# Altium project general-schematics.PrjPCB (part 2 of 2)

## Sheet heater-control-comparator.SchDoc: Heater Control
size A; DrawnBy: B. Almeida, D. Vogel; Organization: UTAT SS; Revision: 1.0
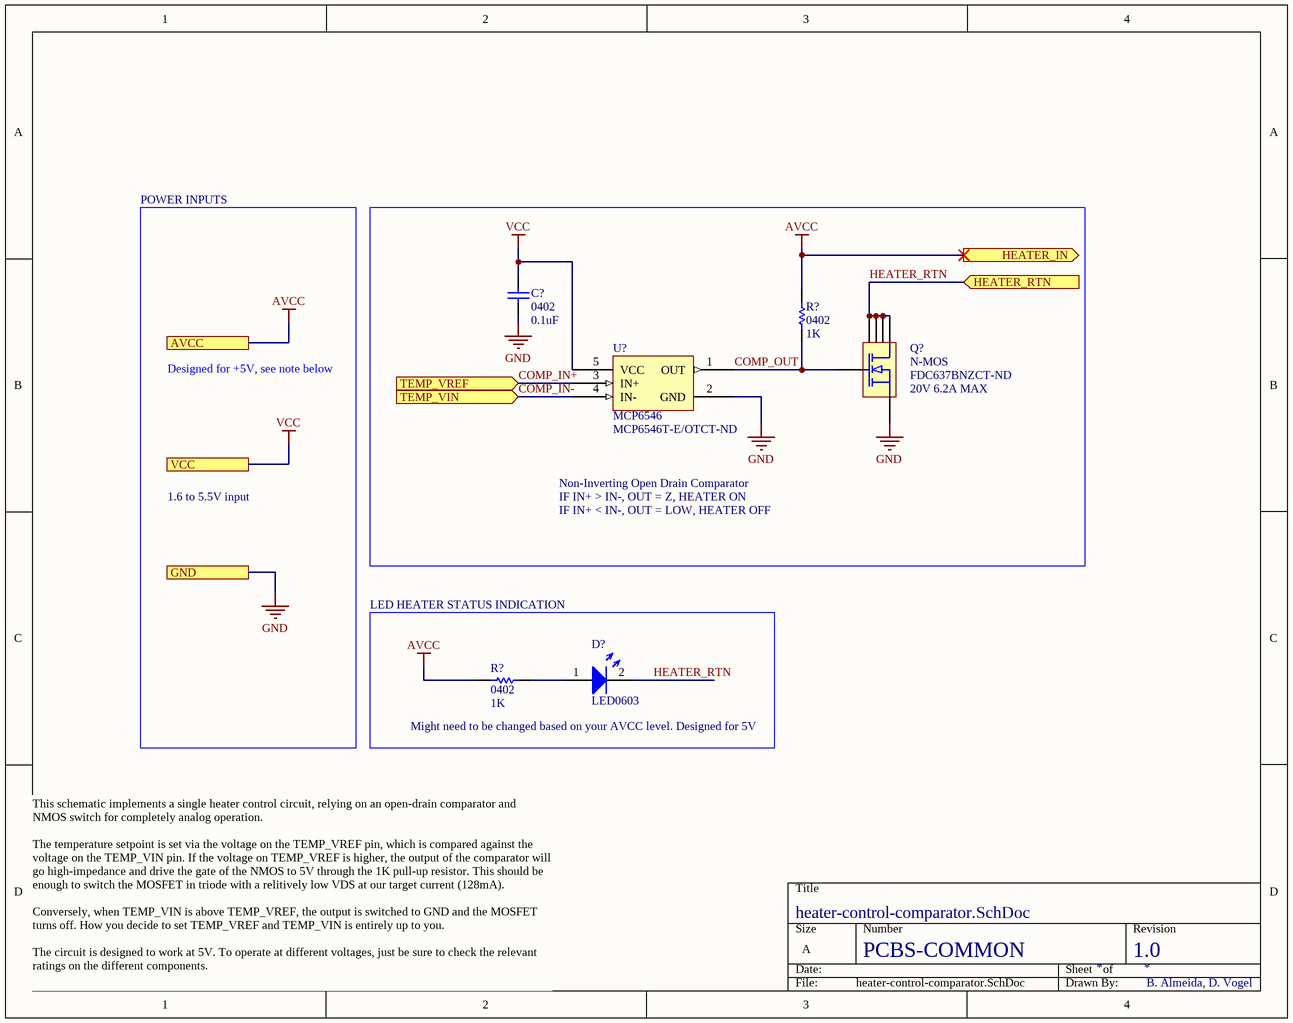
[diagram p7: heater-control-comparator.SchDoc]

### Parts
(Parts that share a designator on the sheet are numbered #1, #2 ... from top to bottom, then left to right.)
C?#25  0402  value 0.1uF  [CAP0402R]
D?#1  LED0603  [LED0603]
Q?  N-MOS  [SOT95P280X145-6N]
R?#23  0402  value 1K  [RES0402R]
R?#24  0402  value 1K  [RES0402R]
U?#9  MCP6546  Supplier Part Number 1: MCP6546T-E/OTCT-ND  [SOT95P290X160-5N]

### Blocks framed on the sheet
LED HEATER STATUS INDICATION: D?#1 R?#24

### Ports
AVCC, GND, HEATER_IN (out), HEATER_RTN (in), TEMP_VIN (in), TEMP_VREF (in), VCC

### Nets
AVCC: R?#23.2 R?#24.1 ; port AVCC, port HEATER_IN
GND: C?#25.1 Q?.4(S) U?#9.2(GND) ; port GND
VCC: C?#25.2 U?#9.5(VCC) ; port VCC
COMP_IN+: U?#9.3(IN+) ; port TEMP_VREF
COMP_IN-: U?#9.4(IN-) ; port TEMP_VIN
COMP_OUT: Q?.3(G) R?#23.1 U?#9.1(OUT)
HEATER_RTN: D?#1.2 Q?.1(D) Q?.2(D) Q?.5(D) Q?.6(D) ; port HEATER_RTN
NetD?#1_1: D?#1.1 R?#24.2

### Notes on the sheet
- POWER INPUTS
- Designed for +5V, see note below
- (near Q?) 20V 6.2A MAX
- 1.6 to 5.5V input
- Non-Inverting Open Drain Comparator
- IF IN+ > IN-, OUT = Z, HEATER ON
- IF IN+ < IN-, OUT = LOW, HEATER OFF
- Might need to be changed based on your AVCC level. Designed for 5V
- PCBS-COMMON
- This schematic implements a single heater control circuit, relying on an open-drain comparator and NMOS switch for completely analog operation.
  The temperature setpoint is set via the voltage on the TEMP_VREF pin, which is compared against the voltage on the TEMP_VIN pin. If the voltage on TEMP_VREF is higher, the output of the comparator will go high-impedance and drive the gate of the NMOS to 5V through the 1K pull-up resistor. This should be enough to switch the MOSFET in triode with a relitively low VDS at our target current (128mA).
  Conversely, when TEMP_VIN is above TEMP_VREF, the output is switched to GND and the MOSFET turns off. How you decide to set TEMP_VREF and TEMP_VIN is entirely up to you.
  The circuit is designed to work at 5V. To operate at different voltages, just be sure to check the relevant ratings on the different components.

### Library data of the parts
C?#25 = CAP0402: 0402 capacitor; Manufacturer: Taiyo Yuden; Manufacturer Part Number: EMK105B7104KVHF; Voltage Rating: 16V; Capacitance: 100nF; Tolerance: 10%; Dielectric: X7R; Supplier 1: Digi-Key; Supplier Part Number 1: 587-3807-1-ND; Stock 1: 18196; Pricing 1: 1=0.1, 10=0.057, 100=0.0254, 500=0.01812, 1000=0.01423, 2500=0.01294, 5000=0.0119 (USD); Mount: Surface Mount; Case/Package: 0402; Weight: 2.3E-05oz; Case Code (Metric): 1005; Case Code (Imperial): 0402; Min Operating Temperature: -55°C; Max Operating Temperature: 125°C; Package Quantity: 10000; Packaging: Tape and Reel; Termination: SMD/SMT; Voltage Rating (DC): 16V; Length: 0.039inch; Height: 0.5mm; Width: 0.02inch; Thickness: 0.022inch; Ratings: AEC-Q200; Lead Free: Lead Free; Halogen Free: Halogen Free
D?#1 = LED0603: Generic 0603 LED. Use ChipLED from Osram for generic ones.
Q? = FDC637BNZCT-ND: 20V 6.2A, N-MOS, low gate on voltage; Supplier 1: Digi-Key; Supplier Part Number 1: FDC637BNZCT-ND
R?#23 R?#24 = RES0402: 0402 resistor; Manufacturer: Panasonic; Manufacturer Part Number: ERJ-PA2J102X; Resistance: 1kR; Tolerance: 5%; Max Power Dissipation: 200mW; Temperature Coefficient: 200ppm/°C; Supplier 1: Digi-Key; Supplier Part Number 1: P17193CT-ND; Stock 1: 7229; Pricing 1: 1=0.16, 10=0.133, 100=0.0518, 1000=0.0217, 2500=0.0199, 5000=0.01809 (USD); Case/Package: 0402; Case Code (Metric): 1005; Case Code (Imperial): 0402; Min Operating Temperature: -55°C; Max Operating Temperature: 155°C; Packaging: Tape and Reel; Composition: Thick Film; Number of Terminations: 2; Features: Automotive AEC-Q200; Length: 0.039inch; Height: 0.016inch; Width: 0.02inch
U?#9 = MCP6546: Open-drain output sub-microamp comparator.; Supplier 1: Digi-Key

## Sheet micro-circuit-ATMEGA64M1.SchDoc: ATMega32M1 Circuit
size A4; DrawnBy: Dylan Vogel; Organization: UTAT SS; Revision: 1.1
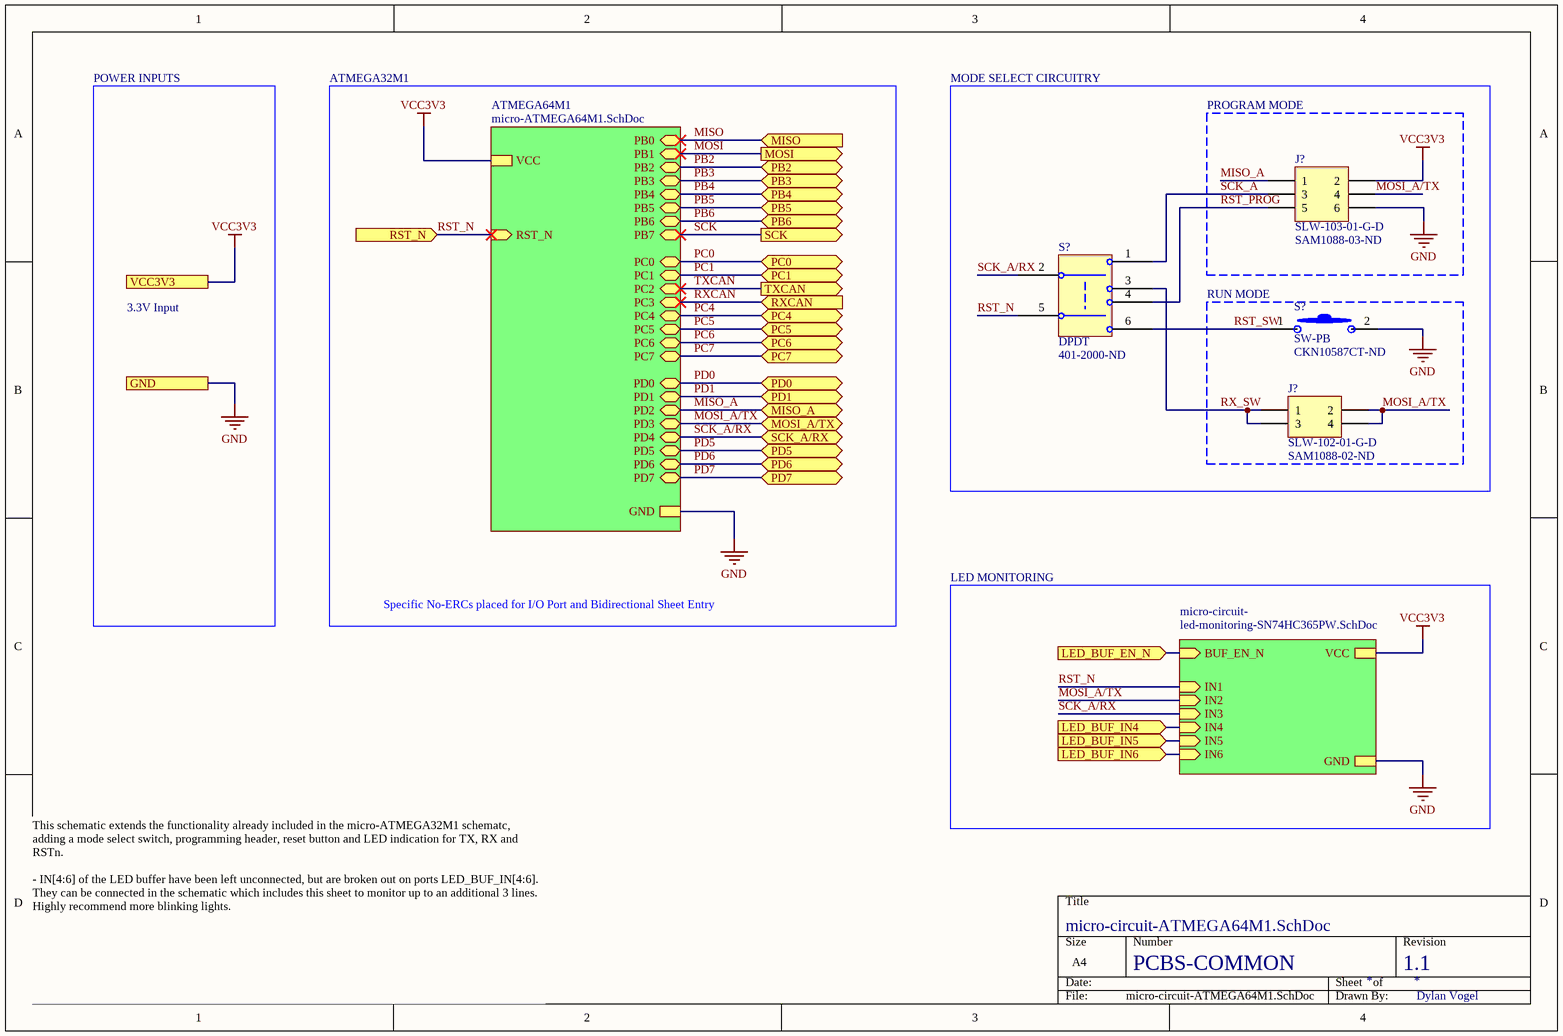
[diagram p8: micro-circuit-ATMEGA64M1.SchDoc]

### Parts
(Parts that share a designator on the sheet are numbered #1, #2 ... from top to bottom, then left to right.)
J?#1  SLW-103-01-G-D  Supplier Part Number 1: SAM1088-03-ND  [SLW-103-01-X-D]
J?#2  SLW-102-01-G-D  Supplier Part Number 1: SAM1088-02-ND  [SLW-102-01-X-D]
S?#1  DPDT  Supplier Part Number 1: 401-2000-ND  [JS202011AQN - Slide Switch]
S?#2  SW-PB  Supplier Part Number 1: CKN10587CT-ND  [PTS830GM140 SMTR LFS - Pushbutton]

### Blocks framed on the sheet
MODE SELECT CIRCUITRY: S?#1
PROGRAM MODE: J?#1
RUN MODE: J?#2 S?#2

### Sub-sheets
ATMEGA64M1 = micro-ATMEGA64M1.SchDoc: GND, PB7 (bidir), RST_N (in), VCC, PD2 (bidir), PC0 (bidir), PD1 (bidir), PD3 (bidir), PD0 (bidir), PC7 (bidir), PD5 (bidir), PC1 (bidir), PC6 (bidir), PB1 (bidir), PB6 (bidir), PC5 (bidir), PC2 (bidir), PB5 (bidir), PC3 (bidir), PD7 (bidir), PB4 (bidir), PB0 (bidir), PC4 (bidir), PD6 (bidir), PB2 (bidir), PB3 (bidir), PD4 (bidir)
micro-circuit- = led-monitoring-SN74HC365PW.SchDoc: IN4 (in), VCC, IN3 (in), IN1 (in), GND, IN2 (in), IN6 (in), IN5 (in), BUF_EN_N (in)  | LED1: GREEN LED; LED2: ORANGE LED; LED3: ORANGE LED

### Ports
GND, LED_BUF_EN_N (in), LED_BUF_IN4 (in), LED_BUF_IN5 (in), LED_BUF_IN6 (in), MISO (in), MISO_A (bidir), MOSI (out), MOSI_A/TX (bidir), PB2 (bidir), PB3 (bidir), PB4 (bidir), PB5 (bidir), PB6 (bidir), PC0 (bidir), PC1 (bidir), PC4 (bidir), PC5 (bidir), PC6 (bidir), PC7 (bidir), PD0 (bidir), PD1 (bidir), PD5 (bidir), PD6 (bidir), PD7 (bidir), RST_N (in), RXCAN (in), SCK (out), SCK_A/RX (bidir), TXCAN (out), VCC3V3

### Nets
GND: J?#1.6 S?#2.2 ; port GND, sheet micro-circuit-/GND, sheet ATMEGA64M1/GND
VCC3V3: J?#1.2 ; port VCC3V3, sheet micro-circuit-/VCC, sheet ATMEGA64M1/VCC  [project net VCC]
BUF_EN_N: port LED_BUF_EN_N, sheet micro-circuit-/BUF_EN_N
IN4: port LED_BUF_IN4, sheet micro-circuit-/IN4
IN5: port LED_BUF_IN5, sheet micro-circuit-/IN5
IN6: port LED_BUF_IN6, sheet micro-circuit-/IN6
MISO: port MISO, sheet ATMEGA64M1/PB0
MISO_A: J?#1.1 ; port MISO_A, sheet ATMEGA64M1/PD2
MOSI: port MOSI, sheet ATMEGA64M1/PB1
MOSI_A/TX: J?#1.4 J?#2.2 J?#2.4 ; port MOSI_A/TX, sheet micro-circuit-/IN2, sheet ATMEGA64M1/PD3
PB2: port PB2, sheet ATMEGA64M1/PB2
PB3: port PB3, sheet ATMEGA64M1/PB3
PB4: port PB4, sheet ATMEGA64M1/PB4
PB5: port PB5, sheet ATMEGA64M1/PB5
PB6: port PB6, sheet ATMEGA64M1/PB6
PC0: port PC0, sheet ATMEGA64M1/PC0
PC1: port PC1, sheet ATMEGA64M1/PC1
PC4: port PC4, sheet ATMEGA64M1/PC4
PC5: port PC5, sheet ATMEGA64M1/PC5
PC6: port PC6, sheet ATMEGA64M1/PC6
PC7: port PC7, sheet ATMEGA64M1/PC7
PD0: port PD0, sheet ATMEGA64M1/PD0
PD1: port PD1, sheet ATMEGA64M1/PD1
PD5: port PD5, sheet ATMEGA64M1/PD5
PD6: port PD6, sheet ATMEGA64M1/PD6
PD7: port PD7, sheet ATMEGA64M1/PD7
RST_N: S?#1.5(POLE2) ; port RST_N, sheet micro-circuit-/IN1, sheet ATMEGA64M1/RST_N
RST_PROG: J?#1.5 S?#1.4(POLE2A)
RST_SW: S?#1.6(POLE2B) S?#2.1
RX_SW: J?#2.1 J?#2.3 S?#1.3(POLE1B)
RXCAN: port RXCAN, sheet ATMEGA64M1/PC3
SCK: port SCK, sheet ATMEGA64M1/PB7
SCK_A: J?#1.3 S?#1.1(POLE1A)
SCK_A/RX: S?#1.2(POLE1) ; port SCK_A/RX, sheet micro-circuit-/IN3, sheet ATMEGA64M1/PD4
TXCAN: port TXCAN, sheet ATMEGA64M1/PC2

### Notes on the sheet
- POWER INPUTS
- ATMEGA32M1
- 3.3V Input
- LED MONITORING
- Specific No-ERCs placed for I/O Port and Bidirectional Sheet Entry
- PCBS-COMMON
- This schematic extends the functionality already included in the micro-ATMEGA32M1 schematc, adding a mode select switch, programming header, reset button and LED indication for TX, RX and RSTn.
  - IN[4:6] of the LED buffer have been left unconnected, but are broken out on ports LED_BUF_IN[4:6]. They can be connected in the schematic which includes this sheet to monitor up to an additional 3 lines. Highly recommend more blinking lights.

### Library data of the parts
J?#1 = SLW-103-01-G-D: 6 pos 100mil pitch low profile header; Supplier 1: Digi-Key
J?#2 = SLW-102-01-G-D: 4 pos 100mil pitch low profile header; Supplier 1: Digi-Key
S?#1 = DPDT Switch: DPDT Switch, customized for the pinout of the JS202011AQN switch.; Supplier 1: Digi-Key
S?#2 = Pushbutton - Low Profile: Schematic symbol for a generic 2-pin pushbutton, OFF-mom.; Supplier 1: Digi-Key

## Sheet led-monitoring-SN74HC365PW.SchDoc: SN74HC365PW LED Monitoring
size A4; DrawnBy: Dylan Vogel; Organization: UTAT SS; Revision: 1.1
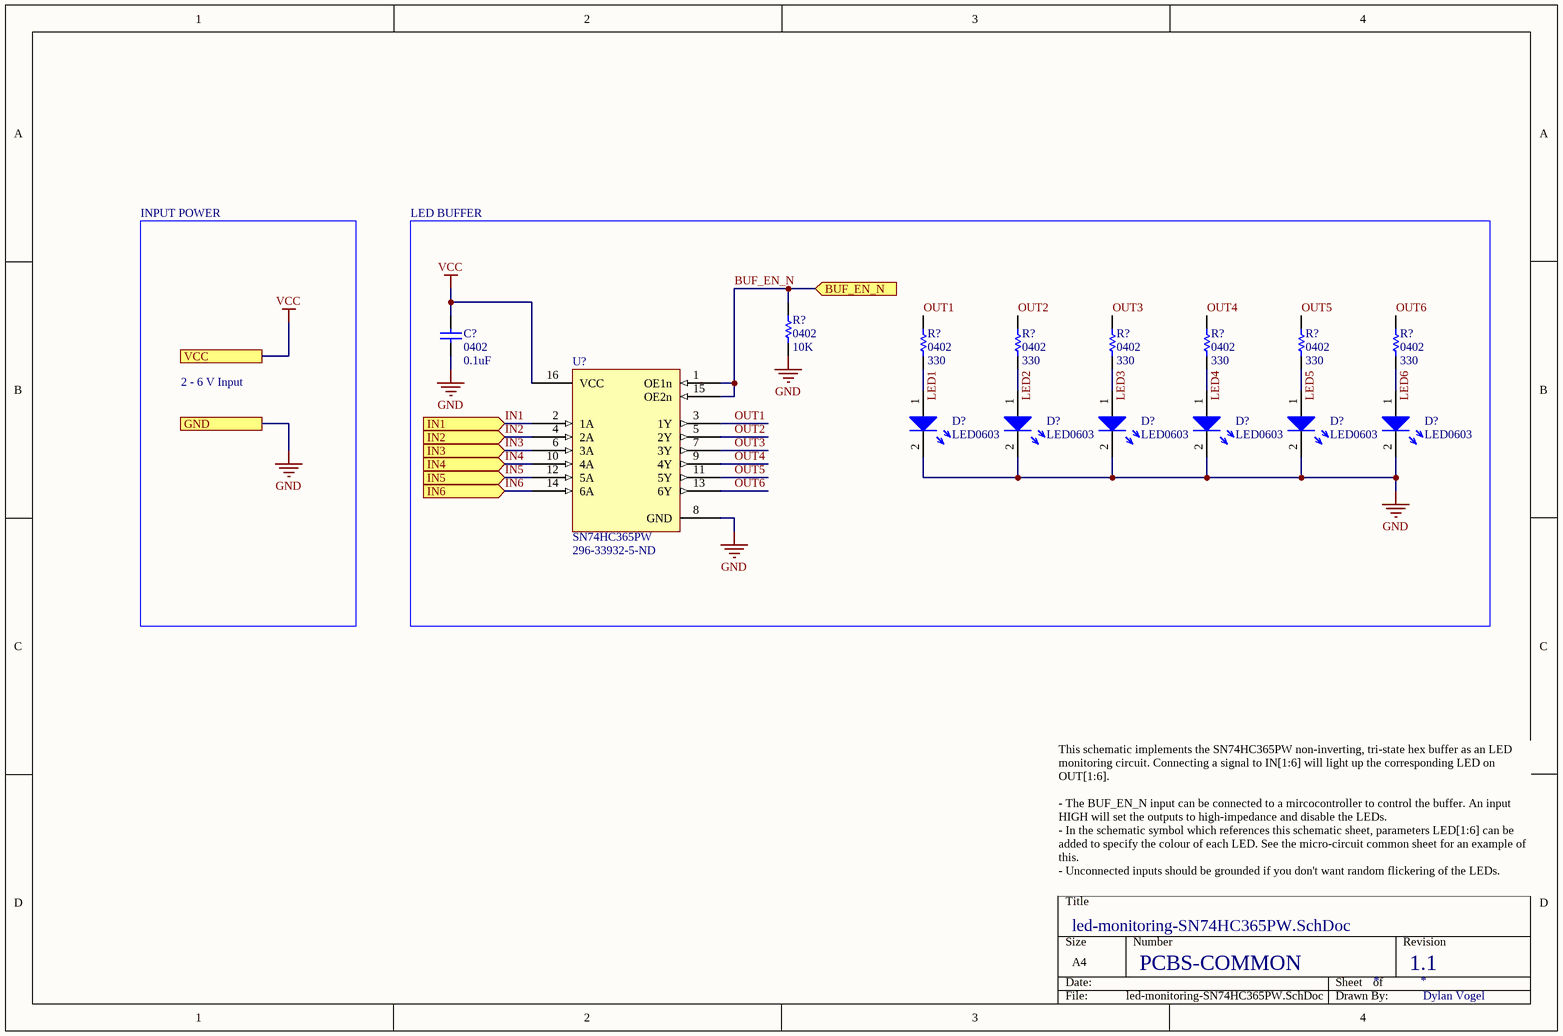
[diagram p9: led-monitoring-SN74HC365PW.SchDoc]

### Parts
(Parts that share a designator on the sheet are numbered #1, #2 ... from top to bottom, then left to right.)
C?#26  0402  value 0.1uF  [CAP0402R]
D?#2  LED0603  [LED0603]
D?#3  LED0603  [LED0603]
D?#4  LED0603  [LED0603]
D?#5  LED0603  [LED0603]
D?#6  LED0603  [LED0603]
D?#7  LED0603  [LED0603]
R?#25  0402  value 10K  [RES0402R]
R?#26  0402  value 330  [RES0402R]
R?#27  0402  value 330  [RES0402R]
R?#28  0402  value 330  [RES0402R]
R?#29  0402  value 330  [RES0402R]
R?#30  0402  value 330  [RES0402R]
R?#31  0402  value 330  [RES0402R]
U?#10  SN74HC365PW  Supplier Part Number 1: 296-33932-5-ND  [SOP65P640X120-16N]

### Blocks framed on the sheet
LED BUFFER: C?#26 D?#2-D?#7 R?#25-R?#31 U?#10

### Ports
BUF_EN_N (in), GND, IN1 (in), IN2 (in), IN3 (in), IN4 (in), IN5 (in), IN6 (in), VCC

### Nets
GND: C?#26.1 D?#2.2 D?#3.2 D?#4.2 D?#5.2 D?#6.2 D?#7.2 R?#25.1 U?#10.8(GND) ; port GND
VCC: C?#26.2 U?#10.16(VCC) ; port VCC
BUF_EN_N: R?#25.2 U?#10.1(OE1n) U?#10.15(OE2n) ; port BUF_EN_N
IN1: U?#10.2(1A) ; port IN1  [project net RST_N]
IN2: U?#10.4(2A) ; port IN2  [project net MOSI_A/TX]
IN3: U?#10.6(3A) ; port IN3  [project net SCK_A/RX]
IN4: U?#10.10(4A) ; port IN4
IN5: U?#10.12(5A) ; port IN5
IN6: U?#10.14(6A) ; port IN6
LED1: D?#2.1 R?#26.1
LED2: D?#3.1 R?#27.1
LED3: D?#4.1 R?#28.1
LED4: D?#5.1 R?#29.1
LED5: D?#6.1 R?#30.1
LED6: D?#7.1 R?#31.1
OUT1: R?#26.2 U?#10.3(1Y)
OUT2: R?#27.2 U?#10.5(2Y)
OUT3: R?#28.2 U?#10.7(3Y)
OUT4: R?#29.2 U?#10.9(4Y)
OUT5: R?#30.2 U?#10.11(5Y)
OUT6: R?#31.2 U?#10.13(6Y)

### Notes on the sheet
- INPUT POWER
- 2 - 6 V Input
- This schematic implements the SN74HC365PW non-inverting, tri-state hex buffer as an LED monitoring circuit. Connecting a signal to IN[1:6] will light up the corresponding LED on OUT[1:6].
  - The BUF_EN_N input can be connected to a mircocontroller to control the buffer. An input HIGH will set the outputs to high-impedance and disable the LEDs.
  - In the schematic symbol which references this schematic sheet, parameters LED[1:6] can be added to specify the colour of each LED. See the micro-circuit common sheet for an example of this.
  - Unconnected inputs should be grounded if you don't want random flickering of the LEDs.
- PCBS-COMMON

### Library data of the parts
C?#26 = CAP0402: 0402 capacitor; Manufacturer: Taiyo Yuden; Manufacturer Part Number: EMK105B7104KVHF; Description: Multilayer Ceramic Capacitors MLCC - SMD/SMT 0.1uF 16V X7R +/-10% 0402 AEC-Q200; Voltage Rating: 16V; Capacitance: 100nF; Tolerance: 10%; Dielectric: X7R; Supplier 1: Digi-Key; Supplier Part Number 1: 587-3807-1-ND; Stock 1: 18196; Pricing 1: 1=0.1, 10=0.057, 100=0.0254, 500=0.01812, 1000=0.01423, 2500=0.01294, 5000=0.0119 (USD); Mount: Surface Mount; Case/Package: 0402; Weight: 2.3E-05oz; Case Code (Metric): 1005; Case Code (Imperial): 0402; Min Operating Temperature: -55°C; Max Operating Temperature: 125°C; Package Quantity: 10000; Packaging: Tape and Reel; Termination: SMD/SMT; Voltage Rating (DC): 16V; Length: 0.039inch; Height: 0.5mm; Width: 0.02inch; Thickness: 0.022inch; Ratings: AEC-Q200; Lead Free: Lead Free; Halogen Free: Halogen Free
D?#2-D?#7 = LED0603: as D?#1 on sheet heater-control-comparator
R?#25 = RES0402: 0402 resistor; Manufacturer: Panasonic; Manufacturer Part Number: ERJ-2RKF1002X; Description: RES SMD 10K OHM 1% 1/10W 0402; Resistance: 10kR; Power Rating: 100mW; Tolerance: 1%; Voltage Rating: 50V; Temperature Coefficient: 100ppm/°C; Supplier 1: Digi-Key; Supplier Part Number 1: P10.0KLCT-ND; Stock 1: 14350001; Pricing 1: 1=0.1, 10=0.045, 100=0.0183, 1000=0.00823, 2500=0.00715, 5000=0.0059 (USD); Mount: Surface Mount; Case/Package: 0402; Number of Pins: 2; Case Code (Metric): 1005; Case Code (Imperial): 0402; Contact Plating: Tin; Min Operating Temperature: -55°C; Max Operating Temperature: 155°C; Packaging: Tape and Reel; Package Quantity: 1; Composition: Thick Film; Number of Terminations: 2; Termination: SMD/SMT; Military Standard: Not; Max Power Dissipation: 100mW; Voltage Rating (DC): 50V; Features: Automotive AEC-Q200; Length: 1mm; Height: 0.35mm; Width: 0.02inch; Depth: 0.5mm; Radiation Hardening: No; REACH SVHC: No SVHC; Lead Free: Lead Free; ComponentLink1URL: http://industrial.panasonic.com/www-data/pdf/AOA0000/AOA0000CE2.pdf?src-supplier=Future+Electronics; ComponentLink1Description: http://industrial.panasonic.com/www-data/pdf/AOA0000/AOA0000CE2.pdf?src-supplier=Future+Electronics; ComponentLink2URL: http://industrial.panasonic.com/www-data/pdf/AOA0000/AOA0000CE2.pdf?src-supplier=Avnet+Europe; ComponentLink2Description: http://industrial.panasonic.com/www-data/pdf/AOA0000/AOA0000CE2.pdf?src-supplier=Avnet+Europe; ComponentLink3URL: https://industrial.panasonic.com/cdbs/www-data/pdf/RDA0000/DMA0000COL11.pdf?src-supplier=Mouser; ComponentLink3Description: https://industrial.panasonic.com/cdbs/www-data/pdf/RDA0000/DMA0000COL11.pdf?src-supplier=Mouser; ComponentLink4URL: http://www.farnell.com/datasheets/1678782.pdf?src-supplier=Element14; ComponentLink4Description: http://www.farnell.com/datasheets/1678782.pdf?src-supplier=Element14; ComponentLink5URL: http://www.farnell.com/datasheets/1911175.pdf?src-supplier=Farnell; ComponentLink5Description: http://www.farnell.com/datasheets/1911175.pdf?src-supplier=Farnell; ComponentLink6URL: http://www.jameco.com/Jameco/Products/ProdDS/1987020.pdf?src-supplier=Jameco; ComponentLink6Description: http://www.jameco.com/Jameco/Products/ProdDS/1987020.pdf?src-supplier=Jameco; ComponentLink7URL: http://industrial.panasonic.com/www-data/pdf/AOA0000/AOA0000CE2.pdf?src-supplier=Avnet; ComponentLink7Description: http://industrial.panasonic.com/www-data/pdf/AOA0000/AOA0000CE2.pdf?src-supplier=Avnet; ComponentLink8URL: http://www.alliedelec.com/m/d/623f45ff1957d936ff56d46fd1c28cac.pdf?src-supplier=Allied+Electronics; ComponentLink8Description: http://www.alliedelec.com/m/d/623f45ff1957d936ff56d46fd1c28cac.pdf?src-supplier=Allied+Electronics
R?#26-R?#31 = RES0402: 0402 resistor; Manufacturer: TE Connectivity; Manufacturer Part Number: CRGCQ0402F330R; Description: CRGCQ 0402 330R 1%; Resistance: 330R; Tolerance: 1%; Max Power Dissipation: 63mW; Temperature Coefficient: 100ppm/°C; Supplier 1: Digi-Key; Supplier Part Number 1: A129621CT-ND; Stock 1: 224275; Pricing 1: 1=0.1, 10=0.022, 100=0.009, 1000=0.00406, 2500=0.00352, 5000=0.00291 (USD); Case/Package: 0402; Case Code (Imperial): 0402; Case Code (Metric): 1005; Min Operating Temperature: -55°C; Max Operating Temperature: 155°C; Composition: Thick Film; Features: Moisture Resistant,Automotive AEC-Q200; Packaging: Tape and Reel; Number of Terminations: 2
U?#10 = SN74HC365PW: Hex non-inverting buffer with 3-state outputs; Supplier 1: Digi-Key

## Sheet micro-ATMEGA64M1.SchDoc: ATMega32M1
size A4; DrawnBy: Dylan Vogel; Organization: UTAT SS; Revision: 1.1
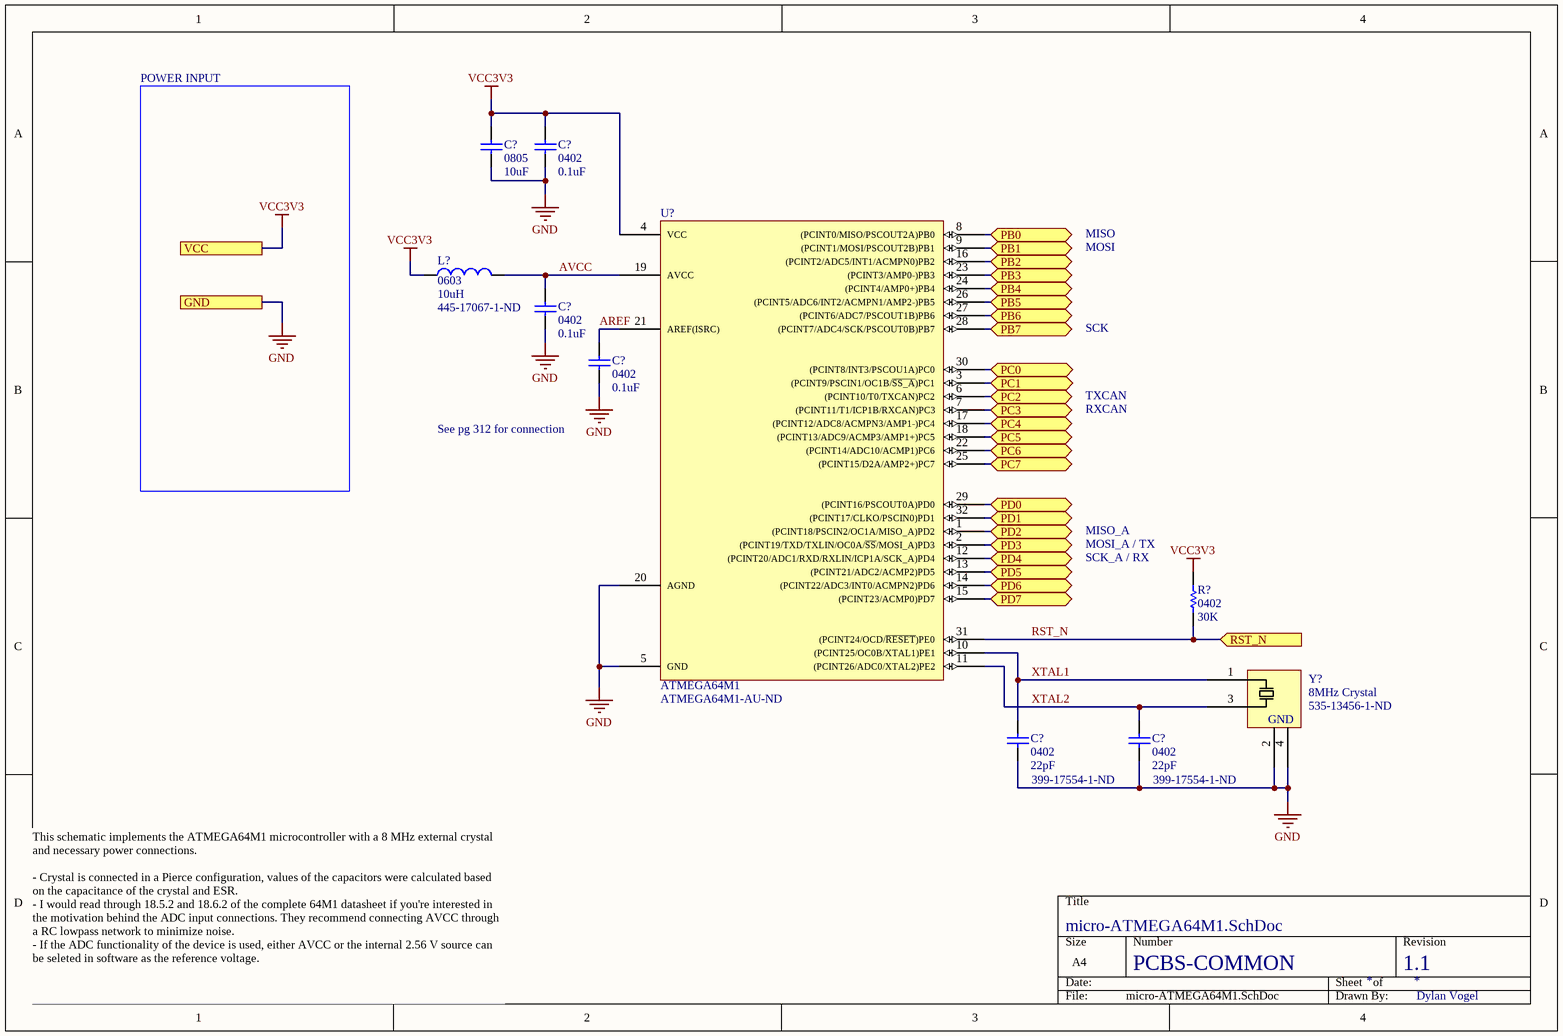
[diagram p10: micro-ATMEGA64M1.SchDoc]

### Parts
(Parts that share a designator on the sheet are numbered #1, #2 ... from top to bottom, then left to right.)
C?#27  0805  value 10uF  [CAP0805R]
C?#28  0402  value 0.1uF  [CAP0402R]
C?#29  0402  value 0.1uF  [CAP0402R]
C?#30  0402  value 0.1uF  [CAP0402R]
C?#31  0402  value 22pF  Supplier Part Number 1: 399-17554-1-ND  [CAP0402R]
C?#32  0402  value 22pF  Supplier Part Number 1: 399-17554-1-ND  [CAP0402R]
L?  0603  value 10uH  Supplier Part Number 1: 445-17067-1-ND  [RES0603R]
R?#32  0402  value 30K  [RES0402R]
U?#11  ATMEGA64M1  Supplier Part Number 1: ATMEGA64M1-AU-ND  [QFP80P900X900X120-32]
Y?  8MHz Crystal  Supplier Part Number 1: 535-13456-1-ND  [OSCSC500X320X110-4N]

### Ports
GND, PB0 (bidir), PB1 (bidir), PB2 (bidir), PB3 (bidir), PB4 (bidir), PB5 (bidir), PB6 (bidir), PB7 (bidir), PC0 (bidir), PC1 (bidir), PC2 (bidir), PC3 (bidir), PC4 (bidir), PC5 (bidir), PC6 (bidir), PC7 (bidir), PD0 (bidir), PD1 (bidir), PD2 (bidir), PD3 (bidir), PD4 (bidir), PD5 (bidir), PD6 (bidir), PD7 (bidir), RST_N (in), VCC

### Nets
GND: C?#27.1 C?#28.1 C?#29.1 C?#30.1 C?#31.1 C?#32.1 U?#11.5(GND) U?#11.20(AGND) Y?.2 Y?.4 ; port GND
VCC3V3: C?#27.2 C?#28.2 L?.1 R?#32.2 U?#11.4(VCC) ; port VCC  [project net VCC]
AREF: C?#30.2 U?#11.21(AREF(ISRC))
AVCC: C?#29.2 L?.2 U?#11.19(AVCC)
MISO: U?#11.8((PCINT0/MISO/PSCOUT2A)PB0) ; port PB0
MISO_A: U?#11.1((PCINT18/PSCIN2/OC1A/MISO_A)PD2) ; port PD2
MOSI: U?#11.9((PCINT1/MOSI/PSCOUT2B)PB1) ; port PB1
MOSI_A/TX: U?#11.2((PCINT19/TXD/TXLIN/OC0A/~{SS}/MOSI_A)PD3) ; port PD3
PB2: U?#11.16((PCINT2/ADC5/INT1/ACMPN0)PB2) ; port PB2
PB3: U?#11.23((PCINT3/AMP0-)PB3) ; port PB3
PB4: U?#11.24((PCINT4/AMP0+)PB4) ; port PB4
PB5: U?#11.26((PCINT5/ADC6/INT2/ACMPN1/AMP2-)PB5) ; port PB5
PB6: U?#11.27((PCINT6/ADC7/PSCOUT1B)PB6) ; port PB6
PC0: U?#11.30((PCINT8/INT3/PSCOU1A)PC0) ; port PC0
PC1: U?#11.3((PCINT9/PSCIN1/OC1B/~{SS_A})PC1) ; port PC1
PC4: U?#11.17((PCINT12/ADC8/ACMPN3/AMP1-)PC4) ; port PC4
PC5: U?#11.18((PCINT13/ADC9/ACMP3/AMP1+)PC5) ; port PC5
PC6: U?#11.22((PCINT14/ADC10/ACMP1)PC6) ; port PC6
PC7: U?#11.25((PCINT15/D2A/AMP2+)PC7) ; port PC7
PD0: U?#11.29((PCINT16/PSCOUT0A)PD0) ; port PD0
PD1: U?#11.32((PCINT17/CLKO/PSCIN0)PD1) ; port PD1
PD5: U?#11.13((PCINT21/ADC2/ACMP2)PD5) ; port PD5
PD6: U?#11.14((PCINT22/ADC3/INT0/ACMPN2)PD6) ; port PD6
PD7: U?#11.15((PCINT23/ACMP0)PD7) ; port PD7
RST_N: R?#32.1 U?#11.31((PCINT24/OCD/~{RESET})PE0) ; port RST_N
RXCAN: U?#11.7((PCINT11/T1/ICP1B/RXCAN)PC3) ; port PC3
SCK: U?#11.28((PCINT7/ADC4/SCK/PSCOUT0B)PB7) ; port PB7
SCK_A/RX: U?#11.12((PCINT20/ADC1/RXD/RXLIN/ICP1A/SCK_A)PD4) ; port PD4
TXCAN: U?#11.6((PCINT10/T0/TXCAN)PC2) ; port PC2
XTAL1: C?#31.2 U?#11.10((PCINT25/OC0B/XTAL1)PE1) Y?.1(IN)
XTAL2: C?#32.2 U?#11.11((PCINT26/ADC0/XTAL2)PE2) Y?.3(IN)

### Notes on the sheet
- POWER INPUT
- MOSI
- MISO
- SCK
- See pg 312 for connection
- TXCAN
- RXCAN
- (near R?#32) MOSI_A / TX
- MISO_A
- (near R?#32) SCK_A / RX
- PCBS-COMMON
- This schematic implements the ATMEGA64M1 microcontroller with a 8 MHz external crystal and necessary power connections.
  - Crystal is connected in a Pierce configuration, values of the capacitors were calculated based on the capacitance of the crystal and ESR.
  - I would read through 18.5.2 and 18.6.2 of the complete 64M1 datasheet if you're interested in the motivation behind the ADC input connections. They recommend connecting AVCC through a RC lowpass network to minimize noise.
  - If the ADC functionality of the device is used, either AVCC or the internal 2.56 V source can be seleted in software as the reference voltage.
- (in symbol AMB3B-8MHz) GND

### Library data of the parts
C?#27 = CAP0805: 0805 capacitor; Manufacturer: Murata; Manufacturer Part Number: GCM21BR70J106KE22K; Description: Cap Ceramic 10uF 6.3V X7R 10% SMD 0805 125C Embossed T/R; Tolerance: 10%; Dielectric: X7R; Voltage Rating (DC): 6.3V; Supplier 1: Digi-Key; Supplier Part Number 1: 490-14361-1-ND; Stock 1: 214938; Pricing 1: 1=0.42, 10=0.29, 100=0.1742, 500=0.13064, 1000=0.11031, 2500=0.10451, 5000=0.0987 (USD); Case/Package: 0805; Min Operating Temperature: -55°C; Max Operating Temperature: 125°C; Capacitance: 10uF; Packaging: Tape and Reel; Length: 2mm; Depth: 1.25mm; Lead Free: Lead Free
C?#28-C?#30 = CAP0402: as C?#26 on sheet led-monitoring-SN74HC365PW; Supplier 1: Digi-Key; Supplier Part Number 1: 587-3807-1-ND; Stock 1: 18196; Pricing 1: 1=0.1, 10=0.057, 100=0.0254, 500=0.01812, 1000=0.01423, 2500=0.01294, 5000=0.0119 (USD); Mount: Surface Mount; Case/Package: 0402; Weight: 2.3E-05oz; Case Code (Metric): 1005; Case Code (Imperial): 0402; Min Operating Temperature: -55°C; Max Operating Temperature: 125°C; Package Quantity: 10000; Packaging: Tape and Reel; Termination: SMD/SMT; Voltage Rating (DC): 16V; Length: 0.039inch; Height: 0.5mm; Width: 0.02inch; Thickness: 0.022inch; Ratings: AEC-Q200; Lead Free: Lead Free; Halogen Free: Halogen Free
C?#31 C?#32 = CAP0402: 0402 capacitor; Manufacturer: KEMET; Manufacturer Part Number: C0402C220K4RAC7867; Description: CAP CER SMD 0402 22PF 10% X7R 16; Tolerance: 10%; Voltage Rating: 16V; Supplier 1: Digi-Key; Stock 1: 68765; Pricing 1: 1=0.19, 10=0.132, 100=0.062, 500=0.0435, 1000=0.03601, 2500=0.03351, 5000=0.03066 (USD); Mount: Surface Mount; Case/Package: 0402; Case Code (Imperial): 0402; Case Code (Metric): 1005; Min Operating Temperature: -55°C; Max Operating Temperature: 125°C; Packaging: Tape and Reel; Capacitance: 22pF
L? = Inductor: Manufacturer: TDK; Manufacturer Part Number: MLZ1608N100LTD25; Code_IEC: 1005; Core Material: Ferrite; Saturation Current: 60mA; Shielding: Shielded; Tolerance: 20%; Current Rating: 300mA; DC Resistance (DCR): 780mR; Test Frequency: 2MHz; Published: 8-Jun-2000; LatestRevisionDate: 29-May-2009; LatestRevisionNote: IPC-7351 Footprint Added.; PackageReference: 0402-A; Publisher: Altium Limited; PackageDescription: Chip Inductor; Code_JEITA: 0402; Supplier 1: Digi-Key; Stock 1: 11876; Pricing 1: 1=0.22, 10=0.202, 100=0.1346, 500=0.11212, 1000=0.09419 (USD); Mount: Surface Mount; Case/Package: 0603; Weight: 0.000141oz; Case Code (Metric): 1608; Case Code (Imperial): 0603; Min Operating Temperature: -55°C; Max Operating Temperature: 125°C; Package Quantity: 4000; Packaging: Tape and Reel; Inductance: 10uH; Termination: SMD/SMT; Max DC Current: 300mA; Length: 0.063inch; Height: 0.8mm; Width: 0.8mm; Height - Seated (Max): 0.037inch; Ratings: AEC-Q200; Lead Free: Lead Free
R?#32 = RES0402: 0402 resistor; Manufacturer: Yageo; Manufacturer Part Number: AC0402FR-0730KL; Description: Thick Film Resistors - SMD 1/16W 30K ohm 1% AEC-Q200; Tolerance: 1%; Power Rating: 62.5mW; Resistance: 30kR; Voltage Rating: 50V; Temperature Coefficient: 100ppm/°C; Max Power Dissipation: 63mW; Supplier 1: Digi-Key; Supplier Part Number 1: YAG3474CT-ND; Stock 1: 756314; Pricing 1: 1=0.1, 10=0.022, 100=0.009, 1000=0.00403, 2500=0.0035, 5000=0.00289 (USD); Case/Package: 0402; Weight: 2.3E-05oz; Case Code (Imperial): 0402; Case Code (Metric): 1005; Min Operating Temperature: -55°C; Max Operating Temperature: 155°C; Packaging: Tape and Reel; Composition: Thick Film; Termination: SMD/SMT; Number of Terminations: 2; Features: Moisture Resistant,Automotive AEC-Q200; Length: 0.039inch; Height: 0.015inch; Width: 0.5mm; Lead Free: Lead Free
U?#11 = ATMEGA64M1_QFP: Atmel 8-bit AVR microcontroller.; Supplier 1: Digi-Key
Y? = AMB3B-8MHz: 8MHz Abracom 4-pin crystal.; Supplier 1: Digi-Key

## Sheet pex-MCP23S17.SchDoc: MCP23S17
size A4; DrawnBy: Dylan  Vogel; Organization: UTAT SS; Revision: 1.1
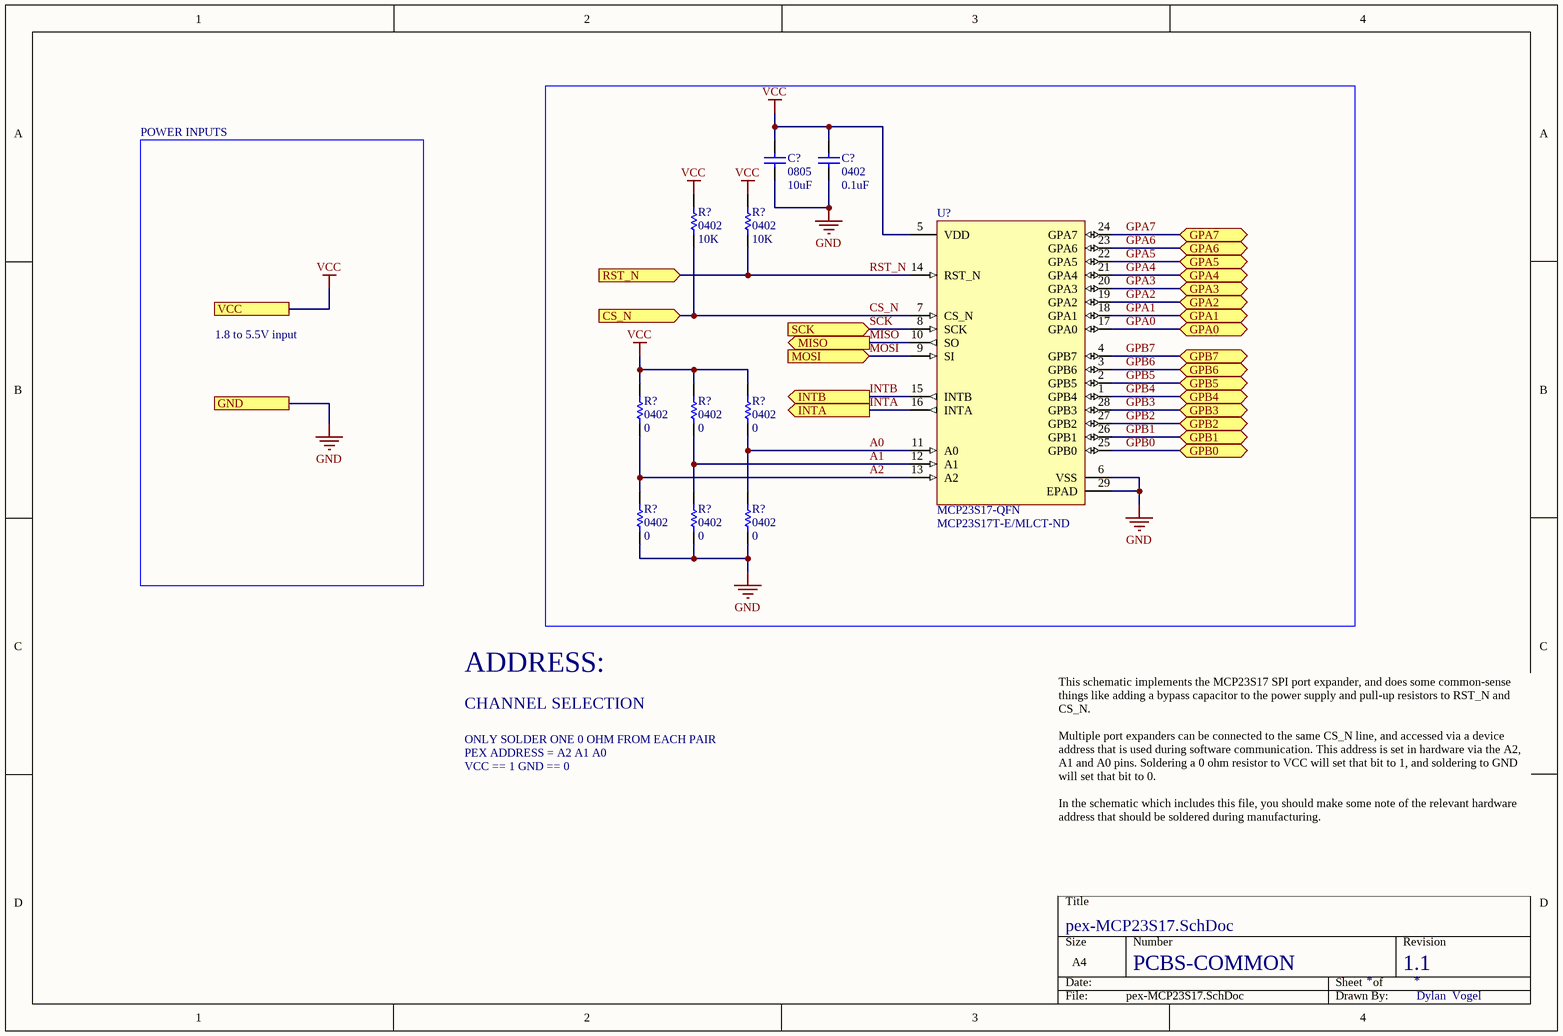
[diagram p11: pex-MCP23S17.SchDoc]

### Parts
(Parts that share a designator on the sheet are numbered #1, #2 ... from top to bottom, then left to right.)
C?#33  0805  value 10uF  [CAP0805R]
C?#34  0402  value 0.1uF  [CAP0402R]
R?#33  0402  value 10K  [RES0402R]
R?#34  0402  value 10K  [RES0402R]
R?#35  0402  value 0  [RES0402R]
R?#36  0402  value 0  [RES0402R]
R?#37  0402  value 0  [RES0402R]
R?#38  0402  value 0  [RES0402R]
R?#39  0402  value 0  [RES0402R]
R?#40  0402  value 0  [RES0402R]
U?#12  MCP23S17-QFN  Supplier Part Number 1: MCP23S17T-E/MLCT-ND  [QFN65P600X600X100-29]

### Ports
CS_N (in), GND, GPA0 (bidir), GPA1 (bidir), GPA2 (bidir), GPA3 (bidir), GPA4 (bidir), GPA5 (bidir), GPA6 (bidir), GPA7 (bidir), GPB0 (bidir), GPB1 (bidir), GPB2 (bidir), GPB3 (bidir), GPB4 (bidir), GPB5 (bidir), GPB6 (bidir), GPB7 (bidir), INTA (out), INTB (out), MISO (out), MOSI (in), RST_N (in), SCK (in), VCC

### Nets
GND: C?#33.1 C?#34.1 R?#38.1 R?#39.1 R?#40.1 U?#12.6(VSS) U?#12.29(EPAD) ; port GND
VCC: C?#33.2 C?#34.2 R?#33.2 R?#34.2 R?#35.2 R?#36.2 R?#37.2 U?#12.5(VDD) ; port VCC
A0: R?#37.1 R?#40.2 U?#12.11(A0)
A1: R?#36.1 R?#39.2 U?#12.12(A1)
A2: R?#35.1 R?#38.2 U?#12.13(A2)
CS_N: R?#33.1 U?#12.7(CS_N) ; port CS_N
GPA0: U?#12.17(GPA0) ; port GPA0
GPA1: U?#12.18(GPA1) ; port GPA1
GPA2: U?#12.19(GPA2) ; port GPA2
GPA3: U?#12.20(GPA3) ; port GPA3
GPA4: U?#12.21(GPA4) ; port GPA4
GPA5: U?#12.22(GPA5) ; port GPA5
GPA6: U?#12.23(GPA6) ; port GPA6
GPA7: U?#12.24(GPA7) ; port GPA7
GPB0: U?#12.25(GPB0) ; port GPB0
GPB1: U?#12.26(GPB1) ; port GPB1
GPB2: U?#12.27(GPB2) ; port GPB2
GPB3: U?#12.28(GPB3) ; port GPB3
GPB4: U?#12.1(GPB4) ; port GPB4
GPB5: U?#12.2(GPB5) ; port GPB5
GPB6: U?#12.3(GPB6) ; port GPB6
GPB7: U?#12.4(GPB7) ; port GPB7
INTA: U?#12.16(INTA) ; port INTA
INTB: U?#12.15(INTB) ; port INTB
MISO: U?#12.10(SO) ; port MISO
MOSI: U?#12.9(SI) ; port MOSI
RST_N: R?#34.1 U?#12.14(RST_N) ; port RST_N
SCK: U?#12.8(SCK) ; port SCK

### Notes on the sheet
- POWER INPUTS
- 1.8 to 5.5V input
- CHANNEL SELECTION
- ADDRESS:
- PEX ADDRESS = A2 A1 A0
- VCC == 1 GND == 0
- ONLY SOLDER ONE 0 OHM FROM EACH PAIR
- This schematic implements the MCP23S17 SPI port expander, and does some common-sense things like adding a bypass capacitor to the power supply and pull-up resistors to RST_N and CS_N.
  Multiple port expanders can be connected to the same CS_N line, and accessed via a device address that is used during software communication. This address is set in hardware via the A2, A1 and A0 pins. Soldering a 0 ohm resistor to VCC will set that bit to 1, and soldering to GND will set that bit to 0.
  In the schematic which includes this file, you should make some note of the relevant hardware address that should be soldered during manufacturing.
- PCBS-COMMON

### Library data of the parts
C?#33 = CAP0805: 0805 capacitor; Manufacturer: Murata; Manufacturer Part Number: GCM21BR70J106KE22K; Tolerance: 10%; Dielectric: X7R; Voltage Rating (DC): 6.3V; Supplier 1: Digi-Key; Supplier Part Number 1: 490-14361-1-ND; Stock 1: 214938; Pricing 1: 1=0.42, 10=0.29, 100=0.1742, 500=0.13064, 1000=0.11031, 2500=0.10451, 5000=0.0987 (USD); Case/Package: 0805; Min Operating Temperature: -55°C; Max Operating Temperature: 125°C; Capacitance: 10uF; Packaging: Tape and Reel; Length: 2mm; Depth: 1.25mm; Lead Free: Lead Free
C?#34 = CAP0402: as C?#25 on sheet heater-control-comparator; Supplier 1: Digi-Key; Supplier Part Number 1: 587-3807-1-ND; Stock 1: 18196; Pricing 1: 1=0.1, 10=0.057, 100=0.0254, 500=0.01812, 1000=0.01423, 2500=0.01294, 5000=0.0119 (USD); Mount: Surface Mount; Case/Package: 0402; Weight: 2.3E-05oz; Case Code (Metric): 1005; Case Code (Imperial): 0402; Min Operating Temperature: -55°C; Max Operating Temperature: 125°C; Package Quantity: 10000; Packaging: Tape and Reel; Termination: SMD/SMT; Voltage Rating (DC): 16V; Length: 0.039inch; Height: 0.5mm; Width: 0.02inch; Thickness: 0.022inch; Ratings: AEC-Q200; Lead Free: Lead Free; Halogen Free: Halogen Free
R?#33 R?#34 = RES0402: 0402 resistor; Manufacturer: Panasonic; Manufacturer Part Number: ERJ-2RKF1002X; Resistance: 10kR; Power Rating: 100mW; Tolerance: 1%; Voltage Rating: 50V; Temperature Coefficient: 100ppm/°C; Supplier 1: Digi-Key; Supplier Part Number 1: P10.0KLCT-ND; Stock 1: 14350001; Pricing 1: 1=0.1, 10=0.045, 100=0.0183, 1000=0.00823, 2500=0.00715, 5000=0.0059 (USD); Mount: Surface Mount; Case/Package: 0402; Number of Pins: 2; Case Code (Metric): 1005; Case Code (Imperial): 0402; Contact Plating: Tin; Min Operating Temperature: -55°C; Max Operating Temperature: 155°C; Packaging: Tape and Reel; Package Quantity: 1; Composition: Thick Film; Number of Terminations: 2; Termination: SMD/SMT; Military Standard: Not; Max Power Dissipation: 100mW; Voltage Rating (DC): 50V; Features: Automotive AEC-Q200; Length: 1mm; Height: 0.35mm; Width: 0.02inch; Depth: 0.5mm; Radiation Hardening: No; REACH SVHC: No SVHC; Lead Free: Lead Free; ComponentLink1URL: http://industrial.panasonic.com/www-data/pdf/AOA0000/AOA0000CE2.pdf?src-supplier=Future+Electronics; ComponentLink1Description: http://industrial.panasonic.com/www-data/pdf/AOA0000/AOA0000CE2.pdf?src-supplier=Future+Electronics; ComponentLink2URL: http://industrial.panasonic.com/www-data/pdf/AOA0000/AOA0000CE2.pdf?src-supplier=Avnet+Europe; ComponentLink2Description: http://industrial.panasonic.com/www-data/pdf/AOA0000/AOA0000CE2.pdf?src-supplier=Avnet+Europe; ComponentLink3URL: https://industrial.panasonic.com/cdbs/www-data/pdf/RDA0000/DMA0000COL11.pdf?src-supplier=Mouser; ComponentLink3Description: https://industrial.panasonic.com/cdbs/www-data/pdf/RDA0000/DMA0000COL11.pdf?src-supplier=Mouser; ComponentLink4URL: http://www.farnell.com/datasheets/1678782.pdf?src-supplier=Element14; ComponentLink4Description: http://www.farnell.com/datasheets/1678782.pdf?src-supplier=Element14; ComponentLink5URL: http://www.farnell.com/datasheets/1911175.pdf?src-supplier=Farnell; ComponentLink5Description: http://www.farnell.com/datasheets/1911175.pdf?src-supplier=Farnell; ComponentLink6URL: http://www.jameco.com/Jameco/Products/ProdDS/1987020.pdf?src-supplier=Jameco; ComponentLink6Description: http://www.jameco.com/Jameco/Products/ProdDS/1987020.pdf?src-supplier=Jameco; ComponentLink7URL: http://industrial.panasonic.com/www-data/pdf/AOA0000/AOA0000CE2.pdf?src-supplier=Avnet; ComponentLink7Description: http://industrial.panasonic.com/www-data/pdf/AOA0000/AOA0000CE2.pdf?src-supplier=Avnet; ComponentLink8URL: http://www.alliedelec.com/m/d/623f45ff1957d936ff56d46fd1c28cac.pdf?src-supplier=Allied+Electronics; ComponentLink8Description: http://www.alliedelec.com/m/d/623f45ff1957d936ff56d46fd1c28cac.pdf?src-supplier=Allied+Electronics
R?#35-R?#40 = RES0402: 0402 resistor; Manufacturer: Panasonic; Manufacturer Part Number: ERJ-2GE0R00X; Resistance: 0mR; Power Rating: 100mW; Voltage Rating: 50V; Tolerance: 5%; Temperature Coefficient: 600ppm/°C; Supplier 1: Digi-Key; Supplier Part Number 1: P0.0JCT-ND; Stock 1: 47740000; Pricing 1: 1=0.1, 10=0.03, 25=0.0216, 50=0.0164, 100=0.0121, 250=0.00924, 500=0.0074, 1000=0.00545, 5000=0.00391 (USD); Mount: Surface Mount; Case/Package: 0402; Case Code (Metric): 1005; Case Code (Imperial): 0402; Contact Plating: Tin; Min Operating Temperature: -55°C; Max Operating Temperature: 155°C; Packaging: Tape and Reel; Package Quantity: 1; Composition: Thick Film; Number of Terminations: 2; Termination: SMD/SMT; Military Standard: Not; Max Power Dissipation: 100mW; Voltage Rating (DC): 50V; Features: Automotive AEC-Q200; Length: 1mm; Height: 0.35mm; Width: 0.02inch; Depth: 0.5mm; Radiation Hardening: No; REACH SVHC: No SVHC; Lead Free: Lead Free; ComponentLink1URL: http://industrial.panasonic.com/www-data/pdf/AOA0000/AOA0000CE1.pdf?src-supplier=Avnet; ComponentLink1Description: http://industrial.panasonic.com/www-data/pdf/AOA0000/AOA0000CE1.pdf?src-supplier=Avnet; ComponentLink2URL: http://www.alliedelec.com/m/d/51cd0790071e1666bdb9d00c57fcf960.pdf?src-supplier=Allied+Electronics; ComponentLink2Description: http://www.alliedelec.com/m/d/51cd0790071e1666bdb9d00c57fcf960.pdf?src-supplier=Allied+Electronics; ComponentLink3URL: http://industrial.panasonic.com/www-data/pdf/AOA0000/AOA0000CE1.pdf?src-supplier=Avnet+Europe; ComponentLink3Description: http://industrial.panasonic.com/www-data/pdf/AOA0000/AOA0000CE1.pdf?src-supplier=Avnet+Europe; ComponentLink4URL: http://www.farnell.com/datasheets/2059623.pdf?src-supplier=Farnell; ComponentLink4Description: http://www.farnell.com/datasheets/2059623.pdf?src-supplier=Farnell; ComponentLink5URL: http://www.farnell.com/datasheets/2059623.pdf?src-supplier=Element14; ComponentLink5Description: http://www.farnell.com/datasheets/2059623.pdf?src-supplier=Element14; ComponentLink6URL: http://www.farnell.com/datasheets/1678796.pdf?src-supplier=Element14; ComponentLink6Description: http://www.farnell.com/datasheets/1678796.pdf?src-supplier=Element14
U?#12 = MCP23S17-QFN: 16 channel SPI port expander; Supplier 1: Digi-Key

## Sheet thermistor-input-10k.SchDoc: Thermistor Input
size A4; DrawnBy: B. Almeida, D. Vogel; Organization: UTAT SS; Revision: 1.2
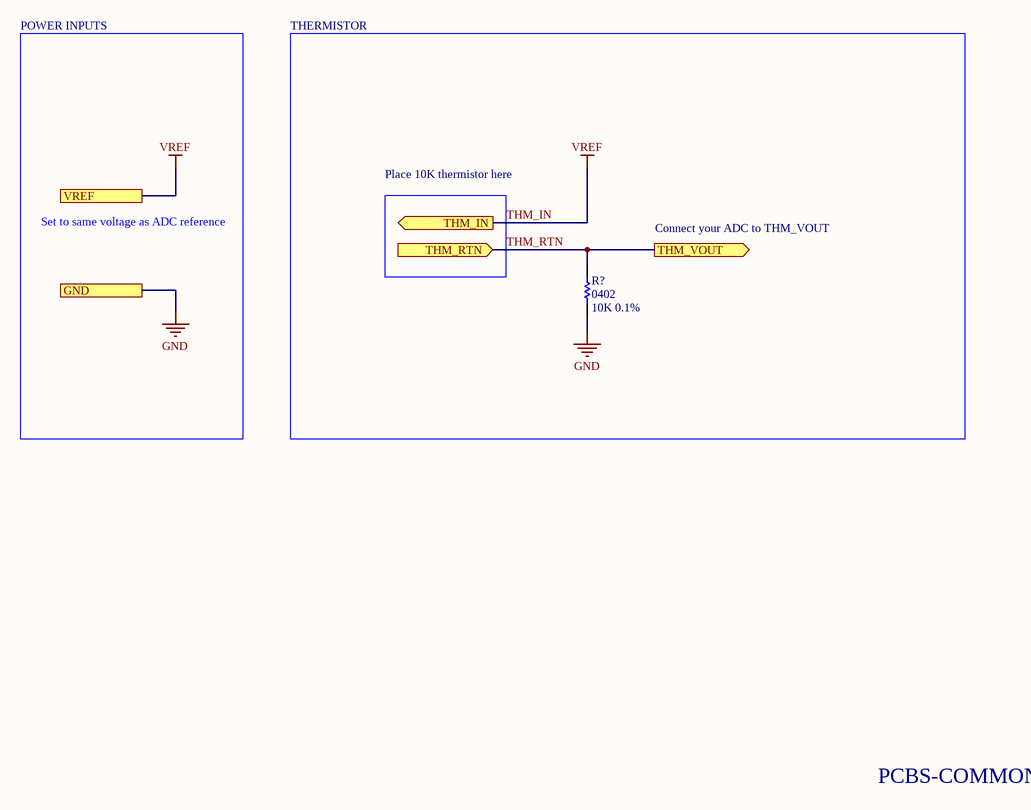
[diagram p12: thermistor-input-10k.SchDoc]

### Parts
(Parts that share a designator on the sheet are numbered #1, #2 ... from top to bottom, then left to right.)
R?#41  0402  value 10K 0.1%  [RES0402R]

### Ports
GND, THM_IN (out), THM_RTN (in), THM_VOUT (out), VREF

### Nets
GND: R?#41.1 ; port GND
VREF: port VREF, port THM_IN  [also labelled THM_IN]
THM_RTN: R?#41.2 ; port THM_VOUT, port THM_RTN

### Notes on the sheet
- POWER INPUTS
- THERMISTOR
- Place 10K thermistor here
- Set to same voltage as ADC reference
- Connect your ADC to THM_VOUT
- PCBS-COMMON

### Library data of the parts
R?#41 = RES0402: 0402 resistor; Manufacturer: Panasonic; Manufacturer Part Number: ERA-2AEB103X; Power Rating: 63mW; Resistance: 10kR; Tolerance: 0.1%; Voltage Rating: 25V; Temperature Coefficient: 25ppm/°C; Supplier 1: Digi-Key; Supplier Part Number 1: P10KDCCT-ND; Stock 1: 1578480; Pricing 1: 1=0.45, 10=0.321, 100=0.1283, 1000=0.06322, 2500=0.05858, 5000=0.053 (USD); Mount: Surface Mount; Case/Package: 0402; Number of Pins: 2; Case Code (Imperial): 0402; Case Code (Metric): 1005; Contact Plating: Tin; Min Operating Temperature: -55°C; Max Operating Temperature: 155°C; Packaging: Tape and Reel; Package Quantity: 1; Composition: Metal Film,Thin Film; Number of Terminations: 2; Termination: SMD/SMT; Military Standard: Not; Max Power Dissipation: 63mW; Voltage Rating (DC): 25V; Features: Automotive AEC-Q200; Length: 1mm; Height: 0.35mm; Width: 0.5mm; Depth: 0.5mm; Radiation Hardening: No; REACH SVHC: No SVHC; Lead Free: Lead Free; ComponentLink1URL: http://uk.rs-online.com/webdocs/0bee/0900766b80beefcc.pdf?src-supplier=RSComponents; ComponentLink1Description: http://uk.rs-online.com/webdocs/0bee/0900766b80beefcc.pdf?src-supplier=RSComponents; ComponentLink2URL: http://industrial.panasonic.com/www-data/pdf/AOA0000/AOA0000CE26.pdf?src-supplier=Avnet; ComponentLink2Description: http://industrial.panasonic.com/www-data/pdf/AOA0000/AOA0000CE26.pdf?src-supplier=Avnet; ComponentLink3URL: http://www.farnell.com/datasheets/328837.pdf?src-supplier=Element14; ComponentLink3Description: http://www.farnell.com/datasheets/328837.pdf?src-supplier=Element14; ComponentLink4URL: http://www.farnell.com/datasheets/2052875.pdf?src-supplier=Farnell; ComponentLink4Description: http://www.farnell.com/datasheets/2052875.pdf?src-supplier=Farnell; ComponentLink5URL: http://industrial.panasonic.com/www-data/pdf/AOA0000/AOA0000CE26.pdf?src-supplier=Future+Electronics; ComponentLink5Description: http://industrial.panasonic.com/www-data/pdf/AOA0000/AOA0000CE26.pdf?src-supplier=Future+Electronics; ComponentLink6URL: http://www.alliedelec.com/m/d/b6b0537e86f421aa7f5975bb1d8f429a.pdf?src-supplier=Allied+Electronics; ComponentLink6Description: http://www.alliedelec.com/m/d/b6b0537e86f421aa7f5975bb1d8f429a.pdf?src-supplier=Allied+Electronics

## Sheet curr-mon-INA214-Q1.SchDoc
size A4; DrawnBy: J. Reimer, D. Vogel; Revision: 1.0
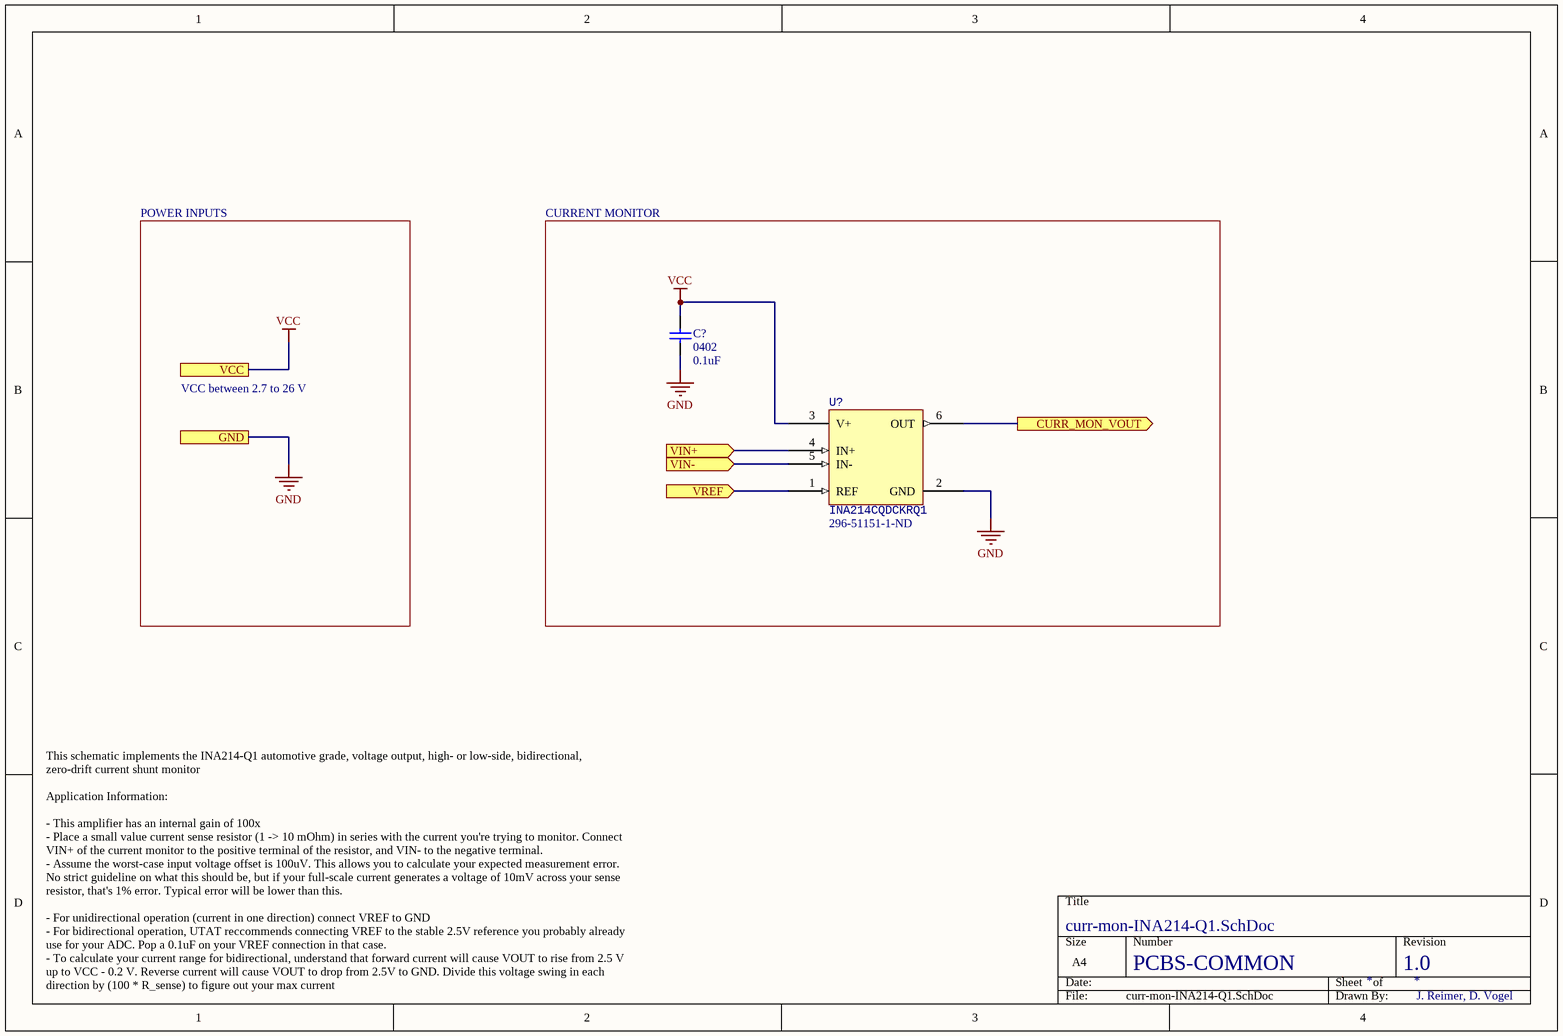
[diagram p13: curr-mon-INA214-Q1.SchDoc]

### Parts
(Parts that share a designator on the sheet are numbered #1, #2 ... from top to bottom, then left to right.)
C?#35  0402  value 0.1uF  [CAP0402R]
U?#13  INA214CQDCKRQ1  Supplier Part Number 1: 296-51151-1-ND  [TI-SOT-SC70 (DCK)]

### Blocks framed on the sheet
CURRENT MONITOR: C?#35 U?#13

### Ports
CURR_MON_VOUT (out), GND, VCC, VIN+ (in), VIN- (in), VREF (in)

### Nets
GND: C?#35.1 U?#13.2(GND) ; port GND
VCC: C?#35.2 U?#13.3(V+) ; port VCC
NetU?#13_1: U?#13.1(REF) ; port VREF
NetU?#13_4: U?#13.4(IN+) ; port VIN+
NetU?#13_5: U?#13.5(IN-) ; port VIN-
NetU?#13_6: U?#13.6(OUT) ; port CURR_MON_VOUT

### Notes on the sheet
- POWER INPUTS
- VCC between 2.7 to 26 V
- This schematic implements the INA214-Q1 automotive grade, voltage output, high- or low-side, bidirectional, zero-drift current shunt monitor
  Application Information:
  - This amplifier has an internal gain of 100x
  - Place a small value current sense resistor (1 -> 10 mOhm) in series with the current you're trying to monitor. Connect VIN+ of the current monitor to the positive terminal of the resistor, and VIN- to the negative terminal.
  - Assume the worst-case input voltage offset is 100uV. This allows you to calculate your expected measurement error. No strict guideline on what this should be, but if your full-scale current generates a voltage of 10mV across your sense resistor, that's 1% error. Typical error will be lower than this.
  - For unidirectional operation (current in one direction) connect VREF to GND
  - For bidirectional operation, UTAT reccommends connecting VREF to the stable 2.5V reference you probably already use for your ADC. Pop a 0.1uF on your VREF connection in that case.
  - To calculate your current range for bidirectional, understand that forward current will cause VOUT to rise from 2.5 V up to VCC - 0.2 V. Reverse current will cause VOUT to drop from 2.5V to GND. Divide this voltage swing in each direction by (100 * R_sense) to figure out your max current
- PCBS-COMMON

### Library data of the parts
C?#35 = CAP0402: as C?#26 on sheet led-monitoring-SN74HC365PW; Supplier 1: Digi-Key; Supplier Part Number 1: 587-3807-1-ND; Stock 1: 17496; Pricing 1: 1=0.1, 10=0.057, 100=0.0254, 500=0.01812, 1000=0.01423, 2500=0.01294, 5000=0.0119 (USD); Mount: Surface Mount; Case/Package: 0402; Weight: 2.3E-05oz; Case Code (Metric): 1005; Case Code (Imperial): 0402; Min Operating Temperature: -55°C; Max Operating Temperature: 125°C; Package Quantity: 10000; Packaging: Tape and Reel; Termination: SMD/SMT; Voltage Rating (DC): 16V; Length: 0.039inch; Height: 0.5mm; Width: 0.02inch; Thickness: 0.022inch; Ratings: AEC-Q200; Lead Free: Lead Free; Halogen Free: Halogen Free
U?#13 = INA214CQDCKRQ1: IC CURR SENSE 1 CIRCUIT SC70-6; Supplier 1: Digi-Key; ComponentLink1Description: Datasheet; ComponentLink1URL: http://www.ti.com/general/docs/suppproductinfo.tsp?distId=10&gotoUrl=http%3A%2F%2Fwww.ti.com%2Flit%2Fgpn%2Fina213-q1

## Nets that join several sheets
AGND: adc-circuit-ADS7952 (7 pins), adc-ADS7952 (11 pins), adc-circuit-ADS7953 (7 pins), adc-ADS7953 (7 pins)
AVCC: adc-circuit-ADS7952 (C?#1.2 C?#3.2 U?#1.5 U?#2.2), adc-ADS7952 (C?#6.2 C?#7.2 U?#3.21 U?#3.32), adc-circuit-ADS7953 (C?#10.2 C?#12.2 U?#4.5 U?#5.2), adc-ADS7953 (C?#15.2 C?#16.2 U?#6.21 U?#6.32), heater-control-comparator (R?#23.2 R?#24.1)
GND: adc-ADS7952 (C?#8.1 U?#3.4 U?#3.27), adc-ADS7953 (C?#17.1 U?#6.4 U?#6.27), can-SN65HVD233 (5 pins), dac-DAC7562 (5 pins), heater-control-comparator (C?#25.1 Q?.4 U?#9.2), micro-circuit-ATMEGA64M1 (J?#1.6 S?#2.2), led-monitoring-SN74HC365PW (9 pins), micro-ATMEGA64M1 (10 pins), pex-MCP23S17 (7 pins), thermistor-input-10k (R?#41.1), curr-mon-INA214-Q1 (C?#35.1 U?#13.2)
VCC: adc-ADS7952 (C?#8.2 R?#6.2 U?#3.28), adc-ADS7953 (C?#17.2 R?#12.2 U?#6.28), can-SN65HVD233 (C?#19.2 C?#20.2 U?#7.3), dac-DAC7562 (5 pins), heater-control-comparator (C?#25.2 U?#9.5), micro-circuit-ATMEGA64M1 (J?#1.2), led-monitoring-SN74HC365PW (C?#26.2 U?#10.16), micro-ATMEGA64M1 (5 pins), pex-MCP23S17 (8 pins), curr-mon-INA214-Q1 (C?#35.2 U?#13.3)
ADC_AINP: adc-circuit-ADS7952 (C?#2.2 R?#3.2), adc-ADS7952 (U?#3.3)
ADC_AINP: adc-circuit-ADS7953 (C?#11.2 R?#9.2), adc-ADS7953 (U?#6.3)
ADC_MXO: adc-circuit-ADS7952 (U?#1.3), adc-ADS7952 (U?#3.2)
ADC_MXO: adc-circuit-ADS7953 (U?#4.3), adc-ADS7953 (U?#6.2)
CS_N_R: adc-circuit-ADS7952 (R?#1.2), adc-ADS7952 (R?#6.1 U?#3.23)
CS_N_R: adc-circuit-ADS7953 (R?#7.2), adc-ADS7953 (R?#12.1 U?#6.23)
MISO_A: micro-circuit-ATMEGA64M1 (J?#1.1), micro-ATMEGA64M1 (U?#11.1)
MISO_R: adc-circuit-ADS7952 (R?#2.2), adc-ADS7952 (U?#3.26)
MISO_R: adc-circuit-ADS7953 (R?#8.2), adc-ADS7953 (U?#6.26)
MOSI_A/TX: micro-circuit-ATMEGA64M1 (J?#1.4 J?#2.2 J?#2.4), led-monitoring-SN74HC365PW (U?#10.4), micro-ATMEGA64M1 (U?#11.2)
MOSI_R: adc-circuit-ADS7952 (R?#4.2), adc-ADS7952 (U?#3.25)
MOSI_R: adc-circuit-ADS7953 (R?#10.2), adc-ADS7953 (U?#6.25)
RST_N: micro-circuit-ATMEGA64M1 (S?#1.5), led-monitoring-SN74HC365PW (U?#10.2), micro-ATMEGA64M1 (R?#32.1 U?#11.31)
SCK_A/RX: micro-circuit-ATMEGA64M1 (S?#1.2), led-monitoring-SN74HC365PW (U?#10.6), micro-ATMEGA64M1 (U?#11.12)
SCLK_R: adc-circuit-ADS7952 (R?#5.2), adc-ADS7952 (U?#3.24)
SCLK_R: adc-circuit-ADS7953 (R?#11.2), adc-ADS7953 (U?#6.24)
VREF_2V5: adc-circuit-ADS7952 (C?#5.2 U?#2.6), adc-ADS7952 (C?#9.2 U?#3.31)
VREF_2V5: adc-circuit-ADS7953 (C?#14.2 U?#5.6), adc-ADS7953 (C?#18.2 U?#6.31)